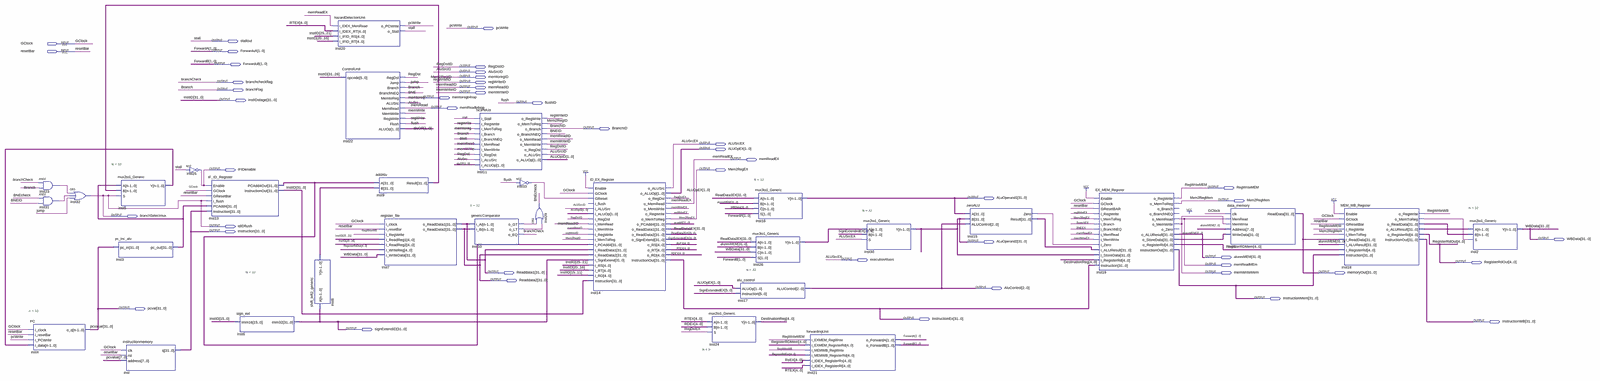
[diagram p0: schematic sheet, whole]
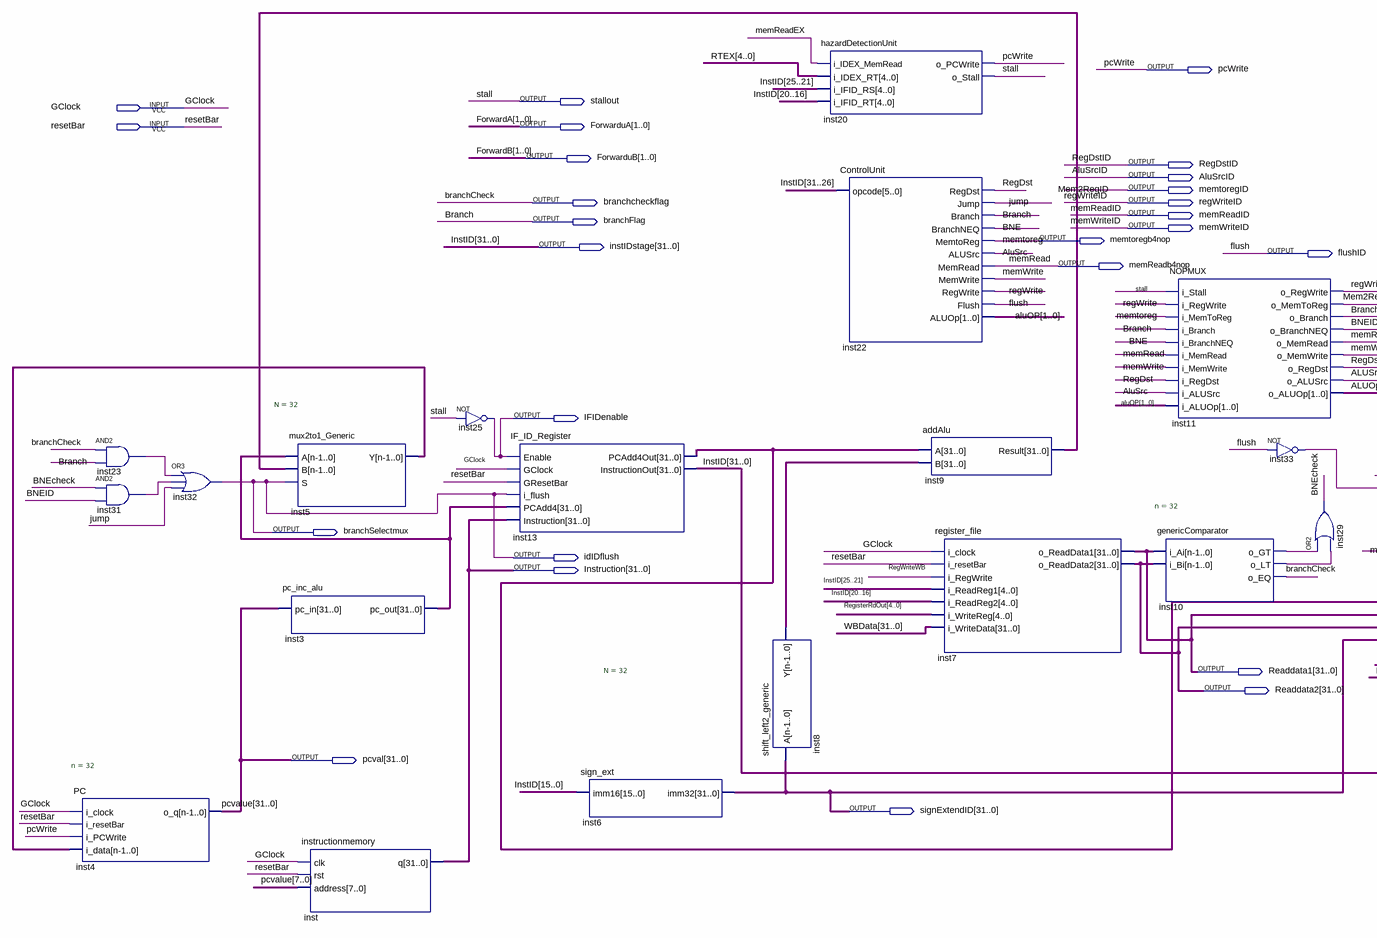
[diagram p1: schematic sheet, left part]
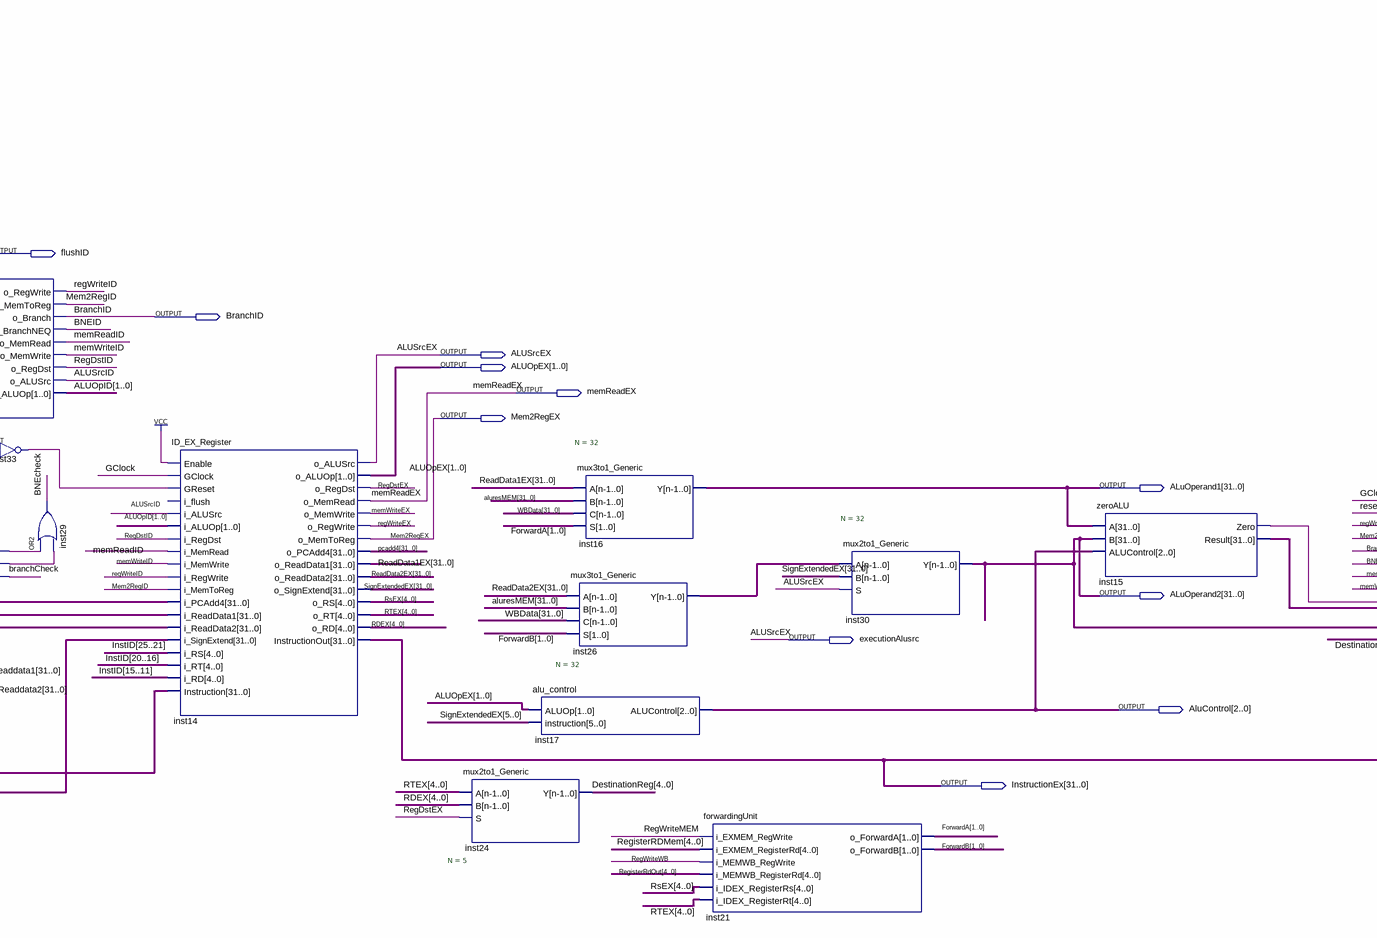
[diagram p2: schematic sheet, centre part]
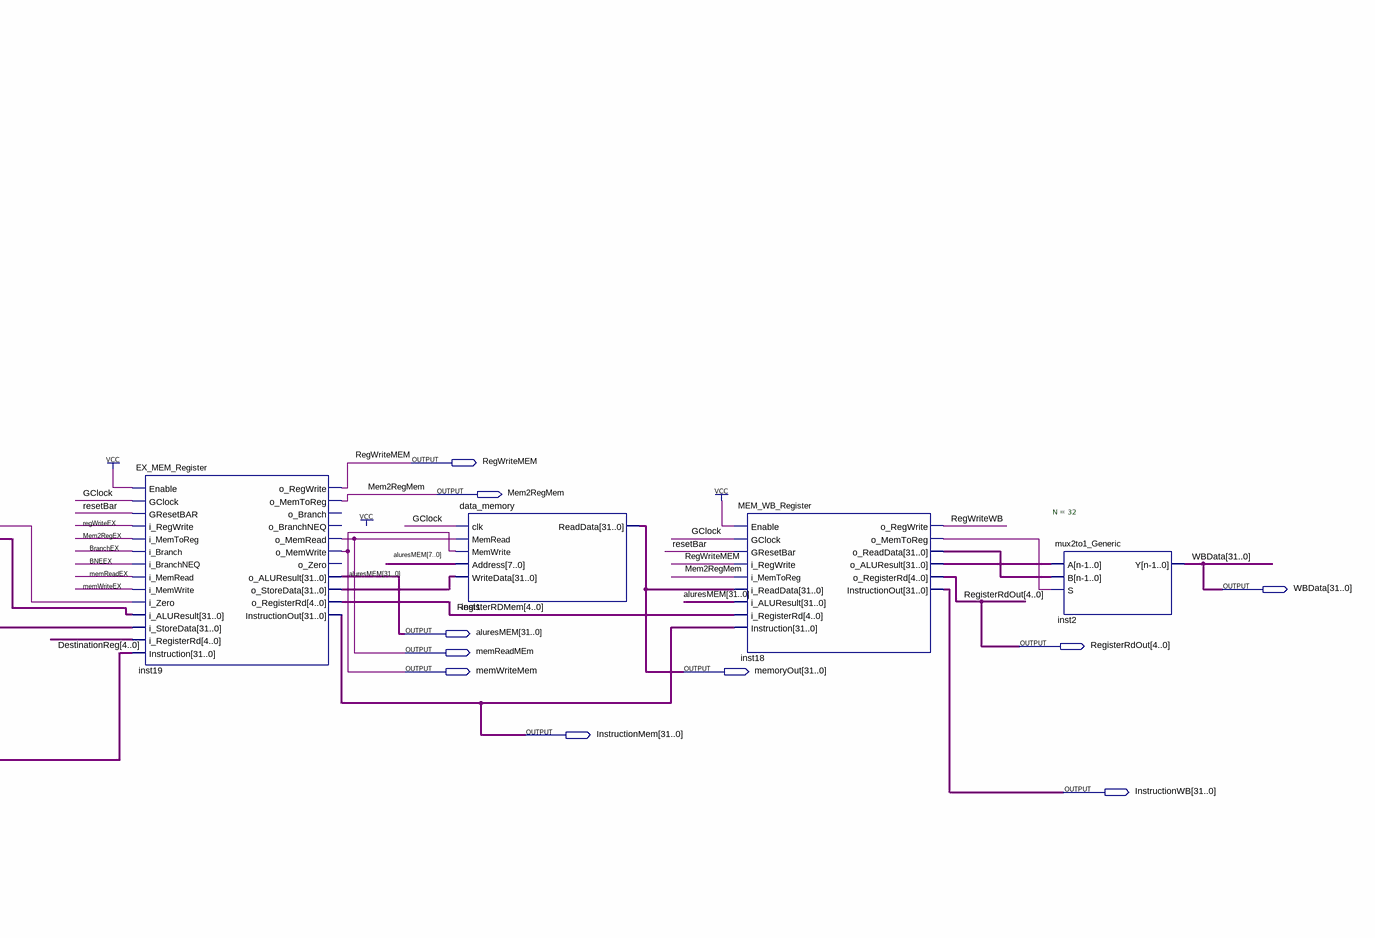
[diagram p3: schematic sheet, right part]
// Quartus schematic PipelinedProcessor.bdf as structural Verilog: 31 symbols, 46 pins
module PipelinedProcessor (
  input  GClock,
  input  resetBar,
  output pcWrite,
  output stallout,
  output [1:0] ForwarduA,
  output [1:0] ForwarduB,
  output RegDstID,
  output AluSrcID,
  output memtoregID,
  output branchcheckflag,
  output regWriteID,
  output memReadID,
  output branchFlag,
  output memWriteID,
  output memtoregb4nop,
  output [31:0] instIDstage,
  output flushID,
  output memReadb4nop,
  output BranchID,
  output ALUSrcEX,
  output [1:0] ALUOpEX,
  output memReadEX,
  output IFIDenable,
  output Mem2RegEX,
  output RegWriteMEM,
  output [31:0] ALuOperand1,
  output Mem2RegMem,
  output branchSelectmux,
  output idIDflush,
  output [31:0] Instruction,
  output [31:0] WBData,
  output [31:0] ALuOperand2,
  output [31:0] aluresMEM,
  output executionAlusrc,
  output [4:0] RegisterRdOut,
  output memReadMEm,
  output [31:0] Readdata1,
  output memWriteMem,
  output [31:0] memoryOut,
  output [31:0] Readdata2,
  output [2:0] AluControl,
  output [31:0] InstructionMem,
  output [31:0] pcval,
  output [31:0] InstructionEx,
  output [31:0] InstructionWB,
  output [31:0] signExtendID
);

  wire AluSrc, BNE, BNEcheck, BNEEX, BNEID, BranchEX, inst10_o_gt, inst10_o_lt, inst15_zero,
       inst18_o_memtoreg, inst23_out, inst31_out, inst33_out, jump, memWrite, memWriteEX, RegDst, RegDstEX,
       regWrite, regWriteEX, RegWriteWB;
  wire [1:0] aluOP, ALUOpID;
  wire [4:0] DestinationReg, RDEX, RegisterRDMem, RsEX, RTEX;
  wire [31:0] inst3_pc_out, inst5_y, inst8_y, inst9_result, inst13_pcadd4out, inst15_result,
       inst18_o_aluresult, inst18_o_readdata, inst19_o_storedata, inst26_y, pcadd4, ReadData1EX, ReadData2EX,
       SignExtendedEX;

  and inst23 (inst23_out, branchcheckflag, branchFlag);
  and inst31 (inst31_out, BNEcheck, BNEID);
  PC #(.n(32)) inst4 (.i_clock(GClock), .i_resetBar(resetBar), .i_PCWrite(pcWrite), .i_data(inst5_y), .o_q(pcval));
  or inst32 (branchSelectmux, inst23_out, inst31_out, jump);
  mux2to1_Generic #(.N(32)) inst5 (.A(inst3_pc_out), .B(inst9_result), .S(branchSelectmux), .Y(inst5_y));
  pc_inc_alu inst3 (.pc_in(pcval), .pc_out(inst3_pc_out));
  instructionmemory inst (.clk(GClock), .rst(resetBar), .address(pcval[7:0]), .q(Instruction));
  not inst25 (IFIDenable, stallout);
  IF_ID_Register inst13 (
    .Enable(IFIDenable), .GClock(GClock), .GResetBar(resetBar), .i_flush(branchSelectmux),
    .PCAdd4(inst3_pc_out), .Instruction(Instruction), .PCAdd4Out(inst13_pcadd4out),
    .InstructionOut(instIDstage));
  sign_ext inst6 (.imm16(instIDstage[15:0]), .imm32(signExtendID));
  shift_left2_generic #(.N(32)) inst8 (.A(signExtendID), .Y(inst8_y));
  hazardDetectionUnit inst20 (
    .i_IDEX_MemRead(memReadEX), .i_IDEX_RT(RTEX), .i_IFID_RS(instIDstage[25:21]),
    .i_IFID_RT(instIDstage[20:16]), .o_PCWrite(pcWrite), .o_Stall(stallout));
  ControlUnit inst22 (
    .opcode(instIDstage[31:26]), .RegDst(RegDst), .Jump(jump), .Branch(branchFlag), .BranchNEQ(BNE),
    .MemtoReg(memtoregb4nop), .ALUSrc(AluSrc), .MemRead(memReadb4nop), .MemWrite(memWrite),
    .RegWrite(regWrite), .Flush(flushID), .ALUOp(aluOP));
  addAlu inst9 (.A(inst13_pcadd4out), .B(inst8_y), .Result(inst9_result));
  register_file inst7 (
    .i_clock(GClock), .i_resetBar(resetBar), .i_RegWrite(RegWriteWB), .i_ReadReg1(instIDstage[25:21]),
    .i_ReadReg2(instIDstage[20:16]), .i_WriteReg(RegisterRdOut), .i_WriteData(WBData),
    .o_ReadData1(Readdata1), .o_ReadData2(Readdata2));
  NOPMUX inst11 (
    .i_Stall(stallout), .i_RegWrite(regWrite), .i_MemToReg(memtoregb4nop), .i_Branch(branchFlag),
    .i_BranchNEQ(BNE), .i_MemRead(memReadb4nop), .i_MemWrite(memWrite), .i_RegDst(RegDst), .i_ALUSrc(AluSrc),
    .i_ALUOp(aluOP), .o_RegWrite(regWriteID), .o_MemToReg(memtoregID), .o_Branch(BranchID),
    .o_BranchNEQ(BNEID), .o_MemRead(memReadID), .o_MemWrite(memWriteID), .o_RegDst(RegDstID),
    .o_ALUSrc(AluSrcID), .o_ALUOp(ALUOpID));
  genericComparator #(.n(32)) inst10 (
    .i_Ai(Readdata1), .i_Bi(Readdata2), .o_GT(inst10_o_gt), .o_LT(inst10_o_lt), .o_EQ(branchcheckflag));
  not inst33 (inst33_out, flushID);
  or inst29 (BNEcheck, inst10_o_gt, inst10_o_lt);
  ID_EX_Register inst14 (
    .Enable(1'b1), .GClock(GClock), .GReset(inst33_out), .i_ALUSrc(AluSrcID), .i_ALUOp(ALUOpID),
    .i_RegDst(RegDstID), .i_MemRead(memReadID), .i_MemWrite(memWriteID), .i_RegWrite(regWriteID),
    .i_MemToReg(memtoregID), .i_PCAdd4(inst13_pcadd4out), .i_ReadData1(Readdata1), .i_ReadData2(Readdata2),
    .i_SignExtend(signExtendID), .i_RS(instIDstage[25:21]), .i_RT(instIDstage[20:16]),
    .i_RD(instIDstage[15:11]), .Instruction(instIDstage), .o_ALUSrc(ALUSrcEX), .o_ALUOp(ALUOpEX),
    .o_RegDst(RegDstEX), .o_MemRead(memReadEX), .o_MemWrite(memWriteEX), .o_RegWrite(regWriteEX),
    .o_MemToReg(Mem2RegEX), .o_PCAdd4(pcadd4), .o_ReadData1(ReadData1EX), .o_ReadData2(ReadData2EX),
    .o_SignExtend(SignExtendedEX), .o_RS(RsEX), .o_RT(RTEX), .o_RD(RDEX), .InstructionOut(InstructionEx));  // open: i_flush
  mux2to1_Generic #(.N(5)) inst24 (.A(RTEX), .B(RDEX), .S(RegDstEX), .Y(DestinationReg));
  alu_control inst17 (.ALUOp(ALUOpEX), .instruction(SignExtendedEX[5:0]), .ALUControl(AluControl));
  mux3to1_Generic #(.N(32)) inst16 (.A(ReadData1EX), .B(aluresMEM), .C(WBData), .S(ForwarduA), .Y(ALuOperand1));
  mux3to1_Generic #(.N(32)) inst26 (.A(ReadData2EX), .B(aluresMEM), .C(WBData), .S(ForwarduB), .Y(inst26_y));
  forwardingUnit inst21 (
    .i_EXMEM_RegWrite(RegWriteMEM), .i_EXMEM_RegisterRd(RegisterRDMem), .i_MEMWB_RegWrite(RegWriteWB),
    .i_MEMWB_RegisterRd(RegisterRdOut), .i_IDEX_RegisterRs(RsEX), .i_IDEX_RegisterRt(RTEX),
    .o_ForwardA(ForwarduA), .o_ForwardB(ForwarduB));
  mux2to1_Generic #(.N(32)) inst30 (.A(inst26_y), .B(SignExtendedEX), .S(ALUSrcEX), .Y(ALuOperand2));
  zeroALU inst15 (
    .A(ALuOperand1), .B(ALuOperand2), .ALUControl(AluControl), .Zero(inst15_zero), .Result(inst15_result));
  EX_MEM_Register inst19 (
    .Enable(1'b1), .GClock(GClock), .GResetBAR(resetBar), .i_RegWrite(regWriteEX), .i_MemToReg(Mem2RegEX),
    .i_Branch(BranchEX), .i_BranchNEQ(BNEEX), .i_MemRead(memReadEX), .i_MemWrite(memWriteEX),
    .i_Zero(inst15_zero), .i_ALUResult(inst15_result), .i_StoreData(ALuOperand2),
    .i_RegisterRd(DestinationReg), .Instruction(InstructionEx), .o_RegWrite(RegWriteMEM),
    .o_MemToReg(Mem2RegMem), .o_MemRead(memReadMEm), .o_MemWrite(memWriteMem), .o_ALUResult(aluresMEM),
    .o_StoreData(inst19_o_storedata), .o_RegisterRd(RegisterRDMem), .InstructionOut(InstructionMem));  // open: o_Branch, o_BranchNEQ, o_Zero
  data_memory inst1 (
    .clk(GClock), .MemRead(memReadMEm), .MemWrite(memWriteMem), .Address(aluresMEM[7:0]),
    .WriteData(inst19_o_storedata), .ReadData(memoryOut));
  MEM_WB_Register inst18 (
    .Enable(1'b1), .GClock(GClock), .GResetBar(resetBar), .i_RegWrite(RegWriteMEM), .i_MemToReg(Mem2RegMem),
    .i_ReadData(memoryOut), .i_ALUResult(aluresMEM), .i_RegisterRd(RegisterRDMem),
    .Instruction(InstructionMem), .o_RegWrite(RegWriteWB), .o_MemToReg(inst18_o_memtoreg),
    .o_ReadData(inst18_o_readdata), .o_ALUResult(inst18_o_aluresult), .o_RegisterRd(RegisterRdOut),
    .InstructionOut(InstructionWB));
  mux2to1_Generic #(.N(32)) inst2 (.A(inst18_o_aluresult), .B(inst18_o_readdata), .S(inst18_o_memtoreg), .Y(WBData));

  assign executionAlusrc = ALUSrcEX;
  assign idIDflush = branchSelectmux;

  // Other names for the same wires on the sheet: Branch = branchFlag; branchCheck = branchcheckflag; flush = flushID;
  //   ForwardA[1:0] = ForwarduA; ForwardB[1:0] = ForwarduB; InstID[31:0] = instIDstage; Mem2RegID = memtoregID;
  //   memRead = memReadb4nop; memtoreg = memtoregb4nop; pcvalue[31:0] = pcval; stall = stallout
endmodule
